# Altium schematic sheet uP_KnightRider.SchDoc
size A4; Organization: Altium Limited; Address1: 3 Minna Close; Address2: Belrose; Address3: NSW 2086; Address4: Australia
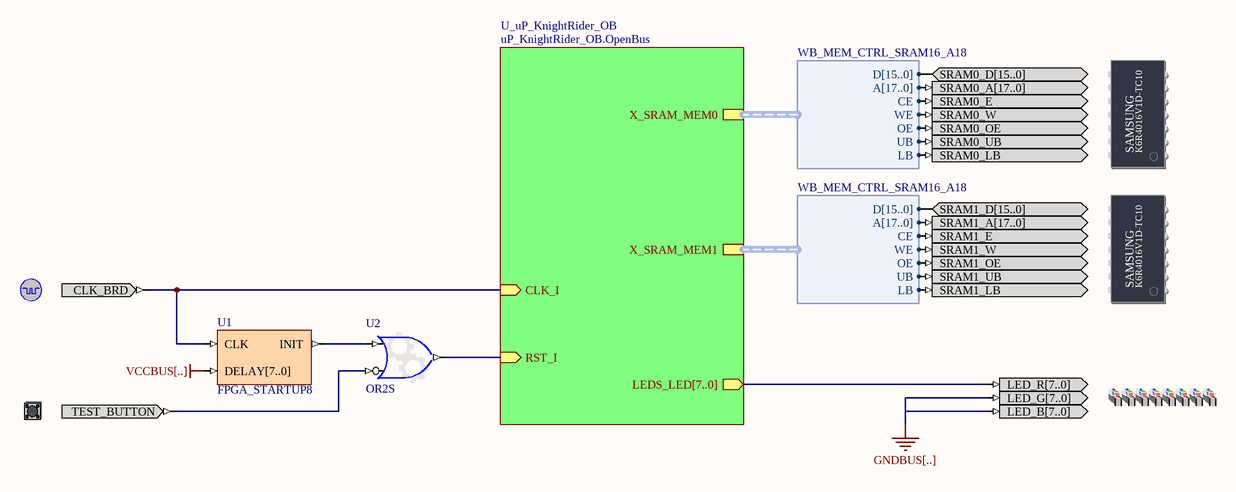
[diagram p0: uP_KnightRider.SchDoc]

## Parts
(Parts that share a designator on the sheet are numbered #1, #2 ... from top to bottom, then left to right.)
?#1  SRAM0  (value not drawn)
?#2  SRAM1  (value not drawn)
?#3  CLOCK_BOARD  (value not drawn)
?#4  LEDS_RGB  (value not drawn)
?#5  TEST_BUTTON  (value not drawn)
U1  FPGA_STARTUP8
U2  OR2S

## Sub-sheets
U_uP_KnightRider_OB = uP_KnightRider_OB.OpenBus: LEDS_LED[7..0] (out), X_SRAM_MEM0 (harness WB_MEM_CTRL_SRAM16_A18), X_SRAM_MEM1 (harness WB_MEM_CTRL_SRAM16_A18), RST_I (in), CLK_I (in)

## Harnesses
WB_MEM_CTRL_SRAM16_A18: D[15..0], A[17..0], CE, WE, OE, UB, LB

## Nets
GNDBUS[..]: ?#4.LED_B[7..0] ?#4.LED_G[7..0]
VCCBUS[..]: U1.DELAY[7..0]
Net?#1_SRAM0_A[17..0]: ?#1.SRAM0_A[17..0] ; sheet U_uP_KnightRider_OB/X_SRAM_MEM0.A[17..0]
Net?#1_SRAM0_D[15..0]: ?#1.SRAM0_D[15..0] ; sheet U_uP_KnightRider_OB/X_SRAM_MEM0.D[15..0]
Net?#1_SRAM0_E: ?#1.SRAM0_E ; sheet U_uP_KnightRider_OB/X_SRAM_MEM0.CE
Net?#1_SRAM0_LB: ?#1.SRAM0_LB ; sheet U_uP_KnightRider_OB/X_SRAM_MEM0.LB
Net?#1_SRAM0_OE: ?#1.SRAM0_OE ; sheet U_uP_KnightRider_OB/X_SRAM_MEM0.OE
Net?#1_SRAM0_UB: ?#1.SRAM0_UB ; sheet U_uP_KnightRider_OB/X_SRAM_MEM0.UB
Net?#1_SRAM0_W: ?#1.SRAM0_W ; sheet U_uP_KnightRider_OB/X_SRAM_MEM0.WE
Net?#2_SRAM1_A[17..0]: ?#2.SRAM1_A[17..0] ; sheet U_uP_KnightRider_OB/X_SRAM_MEM1.A[17..0]
Net?#2_SRAM1_D[15..0]: ?#2.SRAM1_D[15..0] ; sheet U_uP_KnightRider_OB/X_SRAM_MEM1.D[15..0]
Net?#2_SRAM1_E: ?#2.SRAM1_E ; sheet U_uP_KnightRider_OB/X_SRAM_MEM1.CE
Net?#2_SRAM1_LB: ?#2.SRAM1_LB ; sheet U_uP_KnightRider_OB/X_SRAM_MEM1.LB
Net?#2_SRAM1_OE: ?#2.SRAM1_OE ; sheet U_uP_KnightRider_OB/X_SRAM_MEM1.OE
Net?#2_SRAM1_UB: ?#2.SRAM1_UB ; sheet U_uP_KnightRider_OB/X_SRAM_MEM1.UB
Net?#2_SRAM1_W: ?#2.SRAM1_W ; sheet U_uP_KnightRider_OB/X_SRAM_MEM1.WE
Net?#3_CLK_BRD: ?#3.CLK_BRD U1.CLK ; sheet U_uP_KnightRider_OB/CLK_I
Net?#4_LED_R[7..0]: ?#4.LED_R[7..0] ; sheet U_uP_KnightRider_OB/LEDS_LED[7..0]
Net?#5_TEST_BUTTON: ?#5.TEST_BUTTON U2.I1
NetU1_INIT: U1.INIT U2.I0
NetU2_O: U2.O ; sheet U_uP_KnightRider_OB/RST_I

## Notes on the sheet
- Title
- Size:
- Date:
- A4
- Number:
- Time:
- Revision:
- Sheet
- of
- File:
- (in symbol SRAM0) SAMSUNG; K6R4016V1D-TC10
- (in symbol SRAM1) SAMSUNG; K6R4016V1D-TC10

## Library data of the parts
?#1 = SRAM0: Free Static RAM - Daughterboard; PortComponent: True; Published: 14-May-2007; Publisher: Altium Limited; HelpURL: TR0149 Technical Reference for Altium's Xilinx Spartan-3 Daughter Board DB30.pdf#page=16
?#2 = SRAM1: Free Static RAM - Daughterboard; PortComponent: True; Published: 14-May-2007; Publisher: Altium Limited; HelpURL: TR0149 Technical Reference for Altium's Xilinx Spartan-3 Daughter Board DB30.pdf#page=16
?#3 = CLOCK_BOARD: Global System Clock Supply; PortComponent: True; Published: 19-Nov-2003; Publisher: Altium Limited; HelpURL: https://wiki.altium.com/display/ADOH/NanoBoard+3000+-+System+Clocks; UseInDSF: True
?#4 = LEDS_RGB: LEDS RGB; PortComponent: True; Published: 11-Mar-2009; Publisher: Altium Limited
?#5 = TEST_BUTTON: Test / Reset Button; PortComponent: True; Published: 19-Nov-2003; Publisher: Altium Limited; HelpURL: TR0143 Technical Reference Manual for Altium's Desktop NanoBoard NB2DSK01.pdf#page=53
U1 = FPGA_STARTUP8: FPGA Startup With 8 Bit Delay; Published: 9-Dec-2004; Publisher: Altium Limited; HelpURL: CR0119 FPGA_STARTUPx Powerup Delay Unit.pdf; LastRevisionNo: 1.00.00; ComponentLink1Description: Core &Resource Usage; ComponentLink1URL: CR0139 FPGA Peripheral Resource Usage.pdf#page=11
U2 = GATE: Configurable Generic Gate; ConfiguratorName: GENERIC_GATE; ConfigurationParameters: {}Version[1.1]{}GateKind[OR]{}BusInput[False]{}GateInputType[Bit]{}GateOutputOption[Normal]{}BusWidth[8]{}RegisterOutputs[False]{}NegativeClockEdge[False]{}InputCount[2]{}InputInvert0[False]{}InputInvert1[True]{}; LastRevisionNo: 1.00.00; Published: 3-Sep-2008; Publisher: Altium Limited